# Altium schematic sheet AMS1117-3.3.SchDoc: AMS1117-3.3
size A4; CompanyName: github.com/aKaReZa75; Revision: 1.0; SheetNumber: 1; SheetTotal: 1; Project_Name: Design Template
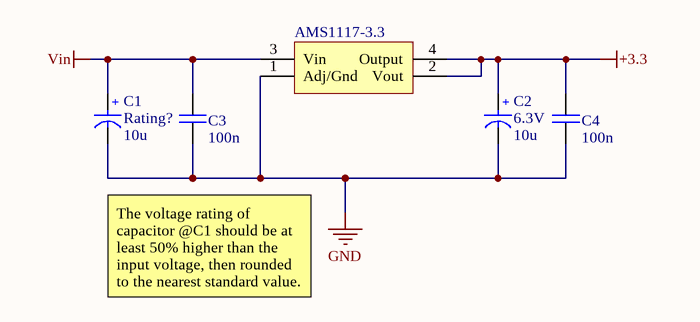
[diagram p0: AMS1117-3.3.SchDoc]

## Parts
AMS1117-3.3  3.3V  [SOT223_M]  (value not drawn)
C1  Rating: Rating?  [SMT_C_Tantalum_B]  (hidden comment: 10u)
C2  Rating: 6.3V  [SMT_C_Tantalum_B]  (hidden comment: 10u)
C3  100n  [CAP 0805/2012]
C4  100n  [CAP 0805/2012]

## Nets
+3.3: AMS1117-3.3.2(Vout) AMS1117-3.3.4(Output) C2.1(+) C4.1
GND: AMS1117-3.3.1(Adj/Gnd) C1.2(-) C2.2(-) C3.2 C4.2
Vin: AMS1117-3.3.3(Vin) C1.1(+) C3.1

## Notes on the sheet
- The voltage rating of capacitor @C1 should be at least 50% higher than the input voltage, then rounded to the nearest standard value.
- Title:
- Project:
- Drawn by:
- Revision:
- Hossein Bagheri
- Company:
- Sheet
- of

## Library data of the parts
AMS1117-3.3 = IC_Reg_AMS1117_3.3: 1'A Positive voltage regulator; Rating: 1A; Inflow: 5217; Validation: Valid; Type: LDO; Package: SOT223; Value: 3.3V
C1 C2 = Cap_Tantalum: Tantalum Capacitor,TAJ Series-SMD; Inflow: inflow?; Validation: Valid; Package: Package?; Type: Tantalum; Value: 10u
C3 C4 = Cap_Multi_SMD_100nF_0805: Bipolar ceramic capacitor SMD; Inflow: inflow?; Type: MultiLayer; Rating: 50V; Validation: Valid; Package: 0805; Value: 100n